# Altium schematic sheet ARM_EURO_Platine2.SchDoc
size A4; PageSetup: Record=PageOptions|CenterHorizontal=True|CenterVertical=True|PrintScale=1.00|XCorrection=1.00|YCorrection=1.00|PrintKind=0|BorderSize=5000000|LeftOffset=0|BottomOffset=0|Orientation=2|PaperLength=1000|PaperWidth=1000|Scale=100|PaperSource=7|PrintQuality=-3|MediaType=1|DitherType=10|PrintScaleMode=1|PaperKind=A4|PaperIndex=9
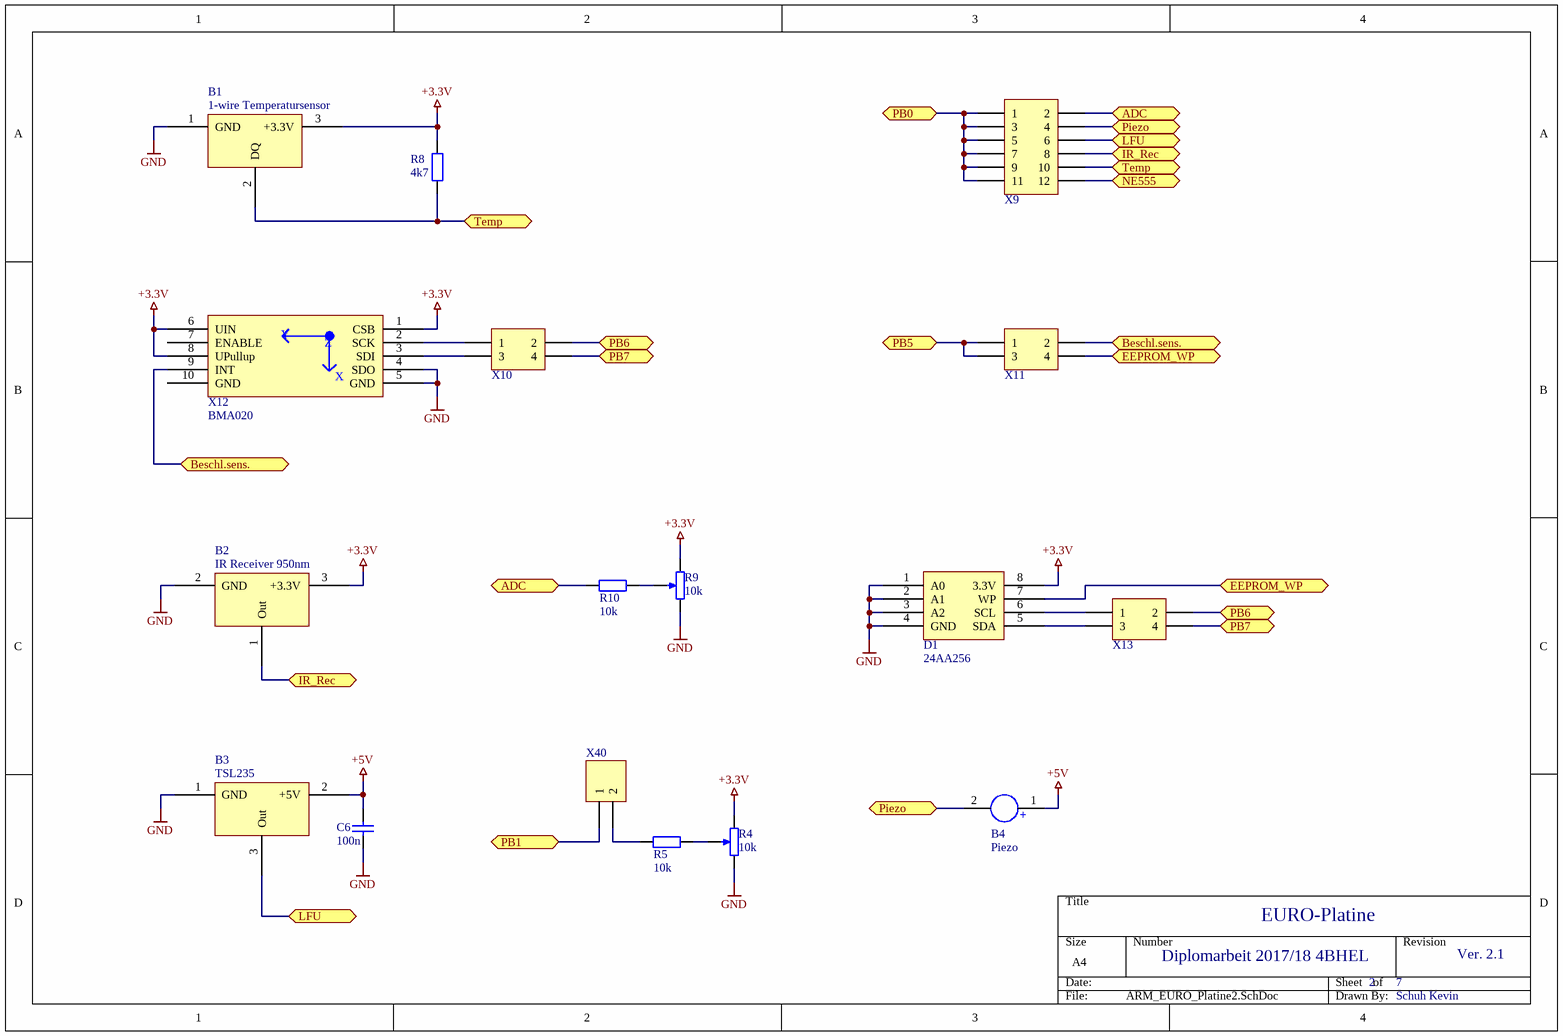
[diagram p0: ARM_EURO_Platine2.SchDoc]

## Parts
B1  1-wire Temperatursensor  [TO_92]
B2  IR Receiver 950nm  [TSOP341]
B3  TSL235  [LFU]
B4  Piezo  [Piezo]
C6  value 100n  [0805_CAP]  (hidden comment: Cap_Keramik_SMD)
D1  24AA256  [PDIP8]
R4  value 10k  [Potentiometer]  (hidden comment: RPot)
R5  value 10k  [0805_Res]  (hidden comment: Res_SMD)
R8  value 4k7  [0805_Res]  (hidden comment: Res_SMD)
R9  value 10k  [Potentiometer]  (hidden comment: RPot)
R10  value 10k  [0805_Res]  (hidden comment: Res_SMD)
X9  Header 6X2A  [HDR2X6]  (value not drawn)
X10  Header_2x2  [HDR2X2]  (value not drawn)
X11  Header_2x2  [HDR2X2]  (value not drawn)
X12  BMA020  [Beschleunigungssensor]
X13  Header_2x2  [HDR2X2]  (value not drawn)
X40  Header  [HDR1X2]  (value not drawn)

## Ports
ADC, Beschl.sens., EEPROM_WP, IR_Rec, LFU, NE555, PB0, PB1, PB5, PB6, PB7, Piezo, Temp

## Nets
+3.3V: B1.3(+3.3V) B2.3(+3.3V) D1.8(3.3V) R4.1(TOP) R8.2 R9.1(TOP) X12.1(CSB) X12.6(UIN) X12.8(UPullup)
+5V: B3.2(+5V) B4.1 C6.2
GND: B1.1(GND) B2.2(GND) B3.1(GND) C6.1 D1.1(A0) D1.2(A1) D1.3(A2) D1.4(GND) R4.2(BOT) R9.2(BOT) X12.4(SDO) X12.5(GND)
ADC: R10.2 X9.2 ; port ADC
Beschl.sens.: X11.2 X12.9(INT) ; port Beschl.sens.
EEPROM_WP: D1.7(WP) X11.4 ; port EEPROM_WP
IR_Rec: B2.1(Out) X9.8 ; port IR_Rec
LFU: B3.3(Out) X9.6 ; port LFU
NE555: X9.12 ; port NE555
PB0: X9.1 X9.3 X9.5 X9.7 X9.9 X9.11 ; port PB0
PB1: X40.1 ; port PB1
PB5: X11.1 X11.3 ; port PB5
PB6: X10.2 X13.2 ; port PB6
PB7: X10.4 X13.4 ; port PB7
Piezo: B4.2 X9.4 ; port Piezo
Temp: B1.2(DQ) R8.1 X9.10 ; port Temp
NetD1_5: D1.5(SDA) X13.3
NetD1_6: D1.6(SCL) X13.1
NetR4_3: R4.3(TAP) R5.1
NetR5_2: R5.2 X40.2
NetR9_3: R9.3(TAP) R10.1
NetX10_1: X10.1 X12.2(SCK)
NetX10_3: X10.3 X12.3(SDI)

Not connected (* = marked no-connect by the designer): X12 7(ENABLE) 10(GND)

## Notes on the sheet
- EURO-Platine
- Diplomarbeit 2017/18 4BHEL
- 2
- 7
- Ver. 2.1
- Schuh Kevin
- (in symbol Beschleunigungssensor) Y; Z; X
- (in symbol Piezo) +

## Library data of the parts
B1 = DS18B20: Temperatursensor
B2 = IR_Receiver: IR-Empfänger; Anbieter: Farnell
B3 = LFU: Licht/Frequenz - Umwandler
B4 = Piezo: Signalgeber
C6 = Cap_Keramik_SMD: Capacitor_SMD; Published: 8-Jun-2000; LatestRevisionDate: 17-Jul-2002; LatestRevisionNote: Re-released for DXP Platform.; PackageReference: RAD-0.3; Publisher: Altium Limited
D1 = EEPROM: 32kx8 EEPROM
R4 R9 = RPot: Potentiometer; Sim Note: Enter the Resistance value and the set point into parameter fields.; Set Position: 0.5; Published: 8-Jun-2000; LatestRevisionDate: 17-Jul-2002; LatestRevisionNote: Re-released for DXP Platform.; PackageReference: VR5; Publisher: Altium Limited
R5 R8 R10 = Res_SMD: Resistor; Published: 8-Jun-2000; LatestRevisionDate: 17-Jul-2002; LatestRevisionNote: Re-released for DXP Platform.; PackageReference: AXIAL-0.4; Publisher: Altium Limited
X9 = Header_6X2A: Header, 6-Pin, Dual row; LatestRevisionDate: 17-Jul-2002; LatestRevisionNote: Re-released for DXP Platform.; Publisher: Altium Limited
X10 X11 X13 = Header_2x2: Header, 3x2-Pin; LatestRevisionDate: 17-Jul-2002; LatestRevisionNote: Re-released for DXP Platform.; Publisher: Altium Limited
X12 = Beschleunigungssensor: 3-Achsen Beschleunigungssensor-Modul; Hersteller: ELV Electronics
X40 = Header_2: Header, 2-Pin; LatestRevisionDate: 17-Jul-2002; LatestRevisionNote: Re-released for DXP Platform.; Publisher: Altium Limited